# EAGLE design power-control (EAGLE 6.4)
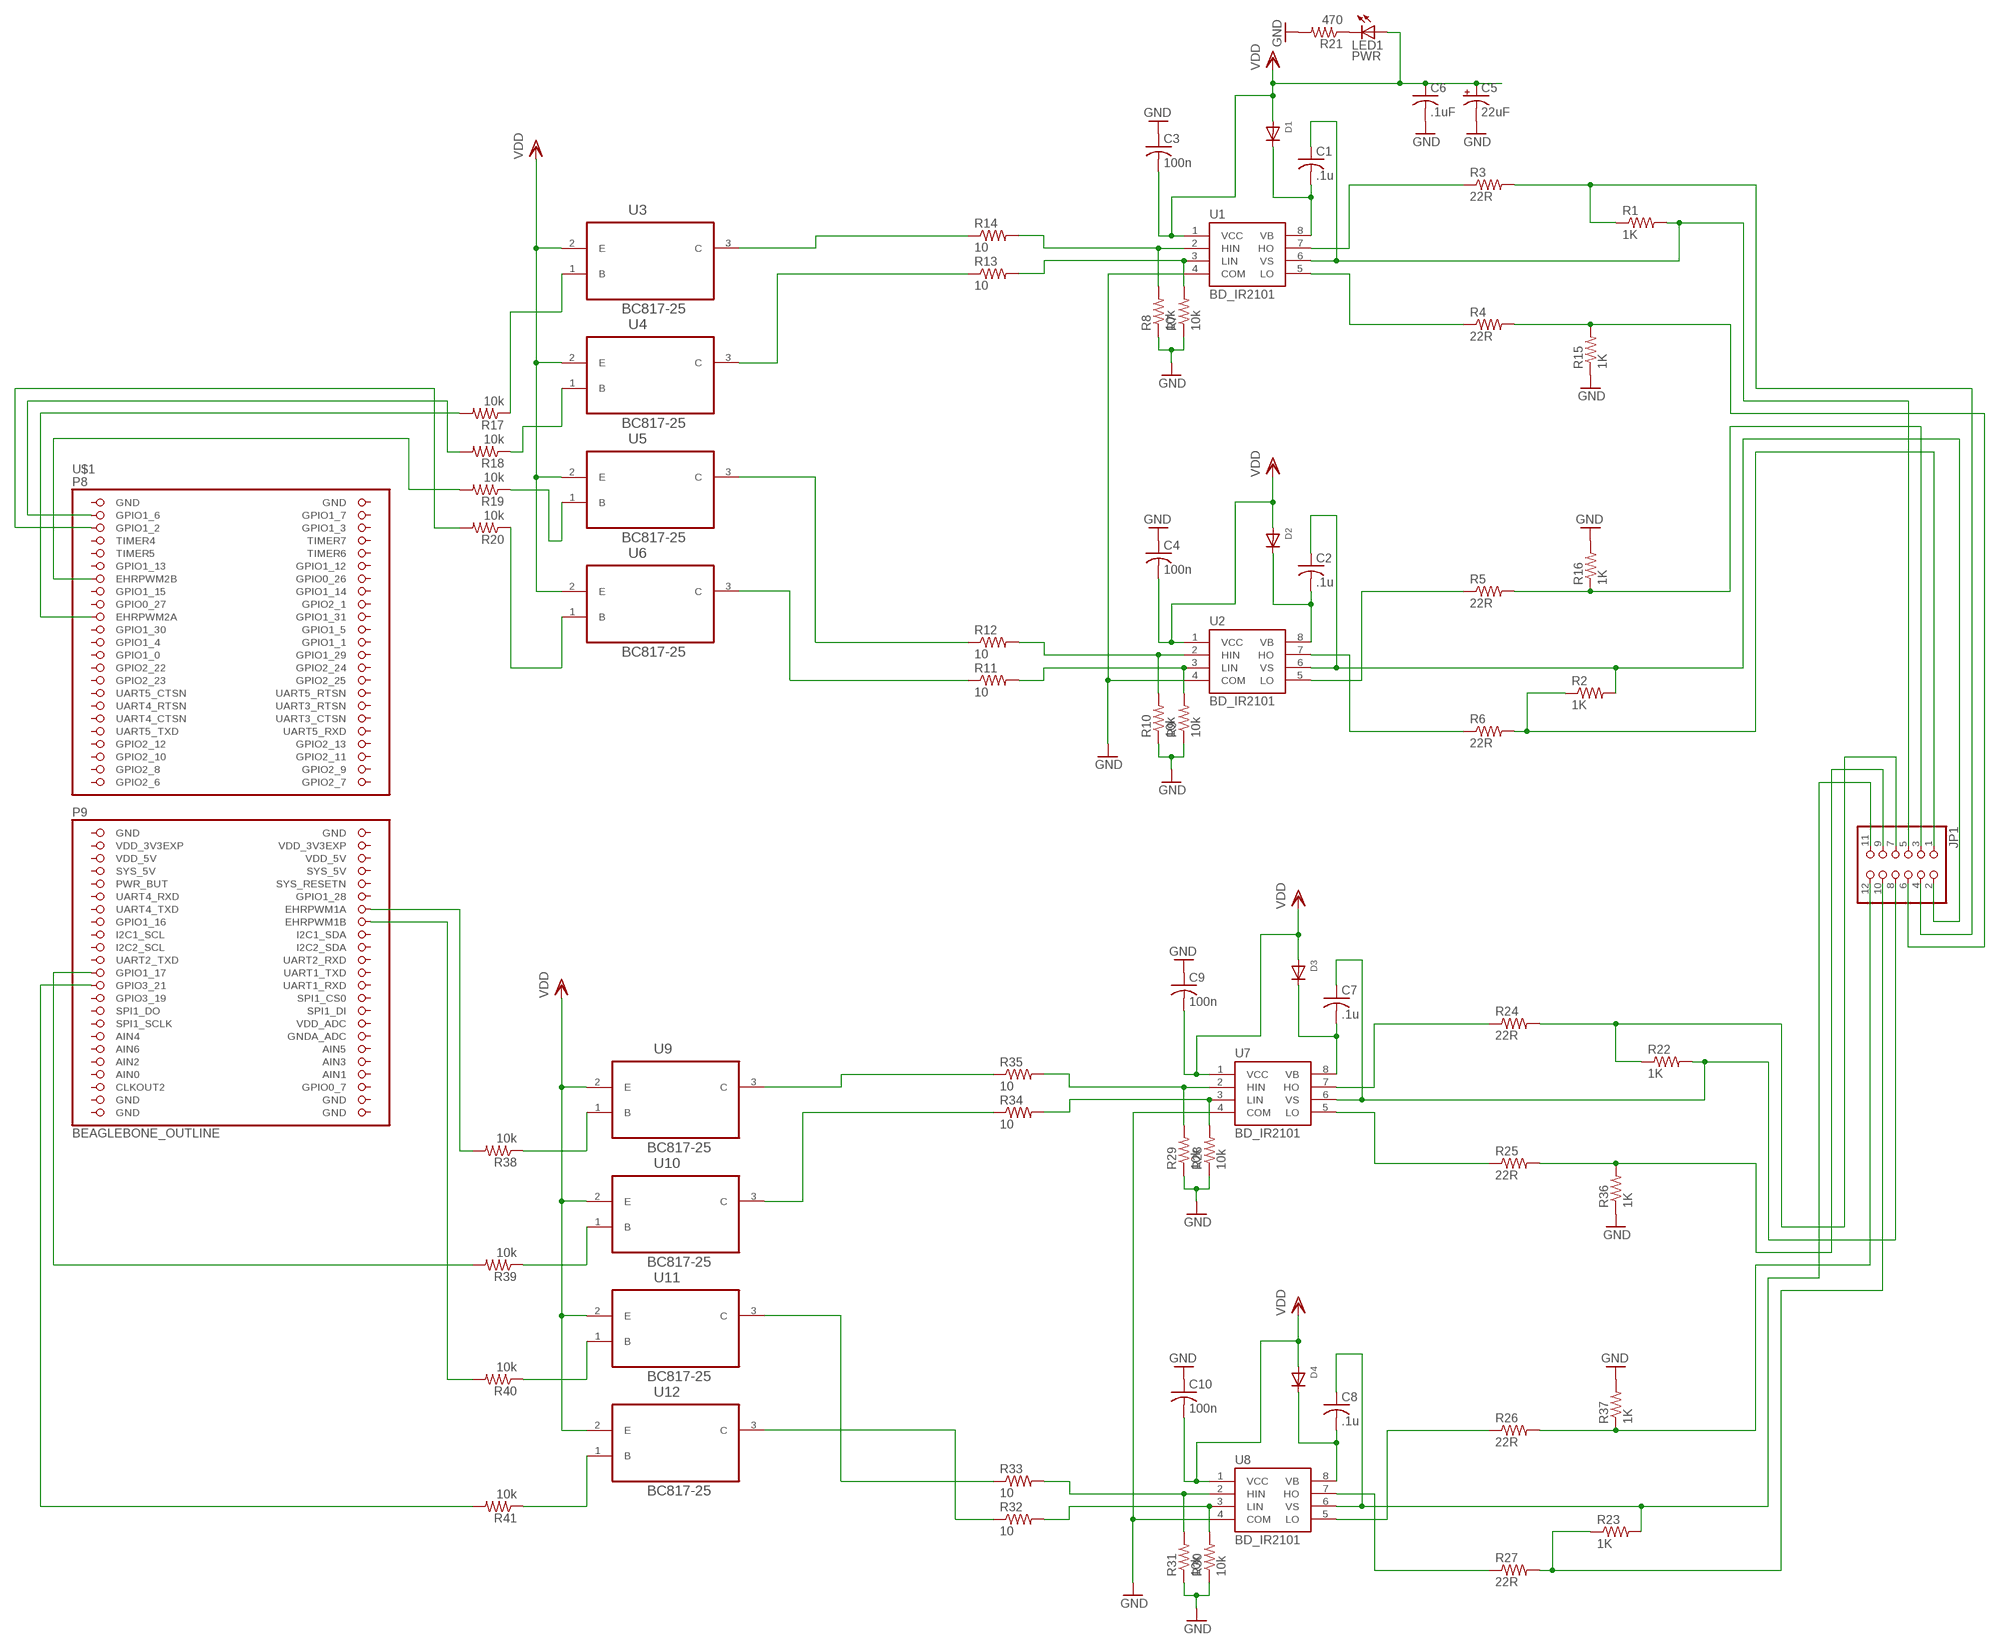
[diagram p0: schematic, sheet 1]

## Parts
C1  .1u  C-USC0402  [C0402]
C2  .1u  C-USC0402  [C0402]
C3  100n  C-USC0402  [C0402]
C4  100n  C-USC0402  [C0402]
C5  22uF  CPOL-USB/3528-21W  [B/3528-21W]
C6  .1uF  C-USC0805  [C0805]
C7  .1u  C-USC0402  [C0402]
C8  .1u  C-USC0402  [C0402]
C9  100n  C-USC0402  [C0402]
C10  100n  C-USC0402  [C0402]
D1  DIODESOD-523  [SOD-523]
D2  DIODESOD-523  [SOD-523]
D3  DIODESOD-523  [SOD-523]
D4  DIODESOD-523  [SOD-523]
JP1  PINHD-2X6_2.00  [2X06M]
LED1  PWR  LEDCHIP-LED0805  [CHIP-LED0805]
R1  1K  R-US_R0603  [R0603]
R2  1K  R-US_R0603  [R0603]
R3  22R  R-US_R0603  [R0603]
R4  22R  R-US_R0603  [R0603]
R5  22R  R-US_R0603  [R0603]
R6  22R  R-US_R0603  [R0603]
R7  10k  R-US_R0603  [R0603]
R8  10k  R-US_R0603  [R0603]
R9  10k  R-US_R0603  [R0603]
R10  10k  R-US_R0603  [R0603]
R11  10  R-US_R0603  [R0603]
R12  10  R-US_R0603  [R0603]
R13  10  R-US_R0603  [R0603]
R14  10  R-US_R0603  [R0603]
R15  1K  R-US_R0603  [R0603]
R16  1K  R-US_R0603  [R0603]
R17  10k  R-US_R0603  [R0603]
R18  10k  R-US_R0603  [R0603]
R19  10k  R-US_R0603  [R0603]
R20  10k  R-US_R0603  [R0603]
R21  470  R-US_R0201  [R0201]
R22  1K  R-US_R0603  [R0603]
R23  1K  R-US_R0603  [R0603]
R24  22R  R-US_R0603  [R0603]
R25  22R  R-US_R0603  [R0603]
R26  22R  R-US_R0603  [R0603]
R27  22R  R-US_R0603  [R0603]
R28  10k  R-US_R0603  [R0603]
R29  10k  R-US_R0603  [R0603]
R30  10k  R-US_R0603  [R0603]
R31  10k  R-US_R0603  [R0603]
R32  10  R-US_R0603  [R0603]
R33  10  R-US_R0603  [R0603]
R34  10  R-US_R0603  [R0603]
R35  10  R-US_R0603  [R0603]
R36  1K  R-US_R0603  [R0603]
R37  1K  R-US_R0603  [R0603]
R38  10k  R-US_R0603  [R0603]
R39  10k  R-US_R0603  [R0603]
R40  10k  R-US_R0603  [R0603]
R41  10k  R-US_R0603  [R0603]
U1  BD_IR2101  [SO8]
U2  BD_IR2101  [SO8]
U3  BC817-25  [SOT95P240X97-3N]
U4  BC817-25  [SOT95P240X97-3N]
U5  BC817-25  [SOT95P240X97-3N]
U6  BC817-25  [SOT95P240X97-3N]
U7  BD_IR2101  [SO8]
U8  BD_IR2101  [SO8]
U9  BC817-25  [SOT95P240X97-3N]
U10  BC817-25  [SOT95P240X97-3N]
U11  BC817-25  [SOT95P240X97-3N]
U12  BC817-25  [SOT95P240X97-3N]
U$1  BEAGLEBONE_OUTLINE  [BEAGLEBONE_SHIELD]

## Nets
GND: C3.1 C4.1 C5.- C6.2 C9.1 C10.1 R7.1 R8.1 R9.1 R10.1 R15.1 R16.2 R21.2 R28.1 R29.1 R30.1 R31.1 R36.1 R37.2 U1.4(COM) U2.4(COM) U7.4(COM) U8.4(COM)
HO_1: R3.1 U1.7(HO)
HO_2: R6.1 U2.7(HO)
HO_3: R24.1 U7.7(HO)
HO_4: R27.1 U8.7(HO)
LO_1: R4.1 U1.5(LO)
LO_2: R5.1 U2.5(LO)
LO_3: R25.1 U7.5(LO)
LO_4: R26.1 U8.5(LO)
M1_G1_H: JP1.4 R1.1 R3.2
M1_G1_L: JP1.6 R4.2 R15.2
M1_G2_H: JP1.1 R2.1 R6.2
M1_G2_L: JP1.3 R5.2 R16.1
M2_G1_H: JP1.7 R22.1 R24.2
M2_G1_L: JP1.9 R25.2 R36.2
M2_G2_H: JP1.10 R23.1 R27.2
M2_G2_L: JP1.12 R26.2 R37.1
MOTOR_OUT_1: C1.1 JP1.5 R1.2 U1.6(VS)
MOTOR_OUT_2: C2.1 JP1.2 R2.2 U2.6(VS)
MOTOR_OUT_3: C7.1 JP1.8 R22.2 U7.6(VS)
MOTOR_OUT_4: C8.1 JP1.11 R23.2 U8.6(VS)
N$1: R13.1 U4.3(C)
N$2: R11.1 U6.3(C)
N$3: R8.2 R14.2 U1.2(HIN)
N$4: R7.2 R13.2 U1.3(LIN)
N$5: R10.2 R12.2 U2.2(HIN)
N$6: R9.2 R11.2 U2.3(LIN)
N$7: C1.2 D1.K(C) U1.8(VB)
N$8: C2.2 D2.K(C) U2.8(VB)
N$9: R12.1 U5.3(C)
N$10: R19.2 U$1.13(EHRPWM2B)
N$11: R14.1 U3.3(C)
N$12: R18.2 U$1.3(GPIO1_6)
N$13: R20.2 U$1.5(GPIO1_2)
N$14: R38.2 U$1.60(EHRPWM1A)
N$15: R40.2 U$1.62(EHRPWM1B)
N$16: R39.2 U$1.69(GPIO1_17)
N$17: R17.1 U3.1(B)
N$18: R18.1 U4.1(B)
N$19: R19.1 U5.1(B)
N$20: R17.2 U$1.19(EHRPWM2A)
N$21: R20.1 U6.1(B)
N$22: LED1.C R21.1
N$23: R29.2 R35.2 U7.2(HIN)
N$24: R28.2 R34.2 U7.3(LIN)
N$25: R41.2 U$1.71(GPIO3_21)
N$26: R31.2 R33.2 U8.2(HIN)
N$27: R30.2 R32.2 U8.3(LIN)
N$28: C7.2 D3.K(C) U7.8(VB)
N$29: C8.2 D4.K(C) U8.8(VB)
N$30: R34.1 U10.3(C)
N$31: R35.1 U9.3(C)
N$32: R32.1 U12.3(C)
N$33: R33.1 U11.3(C)
N$42: R38.1 U9.1(B)
N$43: R39.1 U10.1(B)
N$44: R40.1 U11.1(B)
N$45: R41.1 U12.1(B)
VDD: C3.2 C4.2 C5.+ C6.1 C9.2 C10.2 D1.A D2.A D3.A D4.A LED1.A U1.1(VCC) U2.1(VCC) U3.2(E) U4.2(E) U5.2(E) U6.2(E) U7.1(VCC) U8.1(VCC) U9.2(E) U10.2(E) U11.2(E) U12.2(E)
Unconnected: U$1.4(GPIO1_7) U$1.6(GPIO1_3) U$1.7(TIMER4) U$1.8(TIMER7) U$1.9(TIMER5) U$1.10(TIMER6) U$1.11(GPIO1_13) U$1.12(GPIO1_12) U$1.14(GPIO0_26) U$1.15(GPIO1_15) U$1.16(GPIO1_14) U$1.17(GPIO0_27) U$1.18(GPIO2_1) U$1.20(GPIO1_31) U$1.21(GPIO1_30) U$1.22(GPIO1_5) U$1.23(GPIO1_4) U$1.24(GPIO1_1) U$1.25(GPIO1_0) U$1.26(GPIO1_29) U$1.27(GPIO2_22) U$1.28(GPIO2_24) U$1.29(GPIO2_23) U$1.30(GPIO2_25) U$1.31(UART5_CTSN) U$1.32(UART5_RTSN) U$1.33(UART4_RTSN) U$1.34(UART3_RTSN) U$1.35(UART4_CTSN) U$1.36(UART3_CTSN) U$1.37(UART5_TXD) U$1.38(UART5_RXD) U$1.39(GPIO2_12) U$1.40(GPIO2_13) U$1.41(GPIO2_10) U$1.42(GPIO2_11) U$1.43(GPIO2_8) U$1.44(GPIO2_9) U$1.45(GPIO2_6) U$1.46(GPIO2_7) U$1.54(SYS_5V) U$1.55(PWR_BUT) U$1.56(SYS_RESETN) U$1.57(UART4_RXD) U$1.58(GPIO1_28) U$1.59(UART4_TXD) U$1.61(GPIO1_16) U$1.63(I2C1_SCL) U$1.64(I2C1_SDA) U$1.65(I2C2_SCL) U$1.66(I2C2_SDA) U$1.67(UART2_TXD) U$1.68(UART2_RXD) U$1.70(UART1_TXD) U$1.72(UART1_RXD) U$1.73(GPIO3_19) U$1.74(SPI1_CS0) U$1.75(SPI1_DO) U$1.76(SPI1_DI) U$1.77(SPI1_SCLK) U$1.78(VDD_ADC) U$1.79(AIN4) U$1.80(GNDA_ADC) U$1.81(AIN6) U$1.82(AIN5) U$1.83(AIN2) U$1.84(AIN3) U$1.86(AIN1) U$1.87(CLKOUT2) U$1.88(GPIO0_7)

## Power pins joined to a net without a drawn wire
AIN0: U$1.85(AIN0)
GND: U$1.1(GND) U$1.2(GND) U$1.47(GND) U$1.48(GND) U$1.89(GND) U$1.90(GND) U$1.91(GND) U$1.92(GND)
SYS_5V: U$1.53(SYS_5V)
VDD_3V3EXP: U$1.49(VDD_3V3EXP) U$1.50(VDD_3V3EXP)
VDD_5V: U$1.51(VDD_5V) U$1.52(VDD_5V)

## Library data of the parts
C1-C4 C6-C10 = rcl:C-US: CAPACITOR, American symbol
C5 = rcl:CPOL-US: POLARIZED CAPACITOR, American symbol
D1-D4 = adafruit:DIODE: Diode SMADIODE - SMA Surface Mount Package 20V 1A Schottky Diode Digikey: 641-1014-6-ND DO-1N4148 - Through Hole Small Current Diode SOD-123 20V 1 A (.5mV Vf) Schottky Diode - Digikey: MBRX120TPMSCT-ND SOD-323 10V 570mA (.38mV Vf, 3ns) Schottky Diode - Digikey: ZLLS410CT-ND SOD-523 30V 30mA Schottky Diode (RB751S-40TE61) - Digikey: RB751S-40TE61CT-ND SOT23-R/W - SOT23 Package (R = Solder Paste/Reflow Ovens, W = Hand-Soldering) BAT54Film 40V 300mA - Digikey: 497-7162-1-ND
JP1 = pinhead-1:PINHD-2X6: PIN HEADER
LED1 = adafruit:LED: LED OSRAM: - CHIPLED LG R971, LG N971, LY N971, LG Q971, LY Q971, LO R971, LY R971 LH N974, LH R974 LS Q976, LO Q976, LY Q976 LO Q996 - Hyper CHIPLED LW Q18S LB Q993, LB Q99A, LB R99A - SideLED LS A670, LO A670, LY A670, LG A670, LP A670 LB A673, LV A673, LT A673, LW A673 LH A674 LY A675 LS A676, LA A676, LO A676, LY A676, LW A676 LS A679, LY A679, LG A679 - Hyper Micro SIDELED® LS Y876, LA Y876, LO Y876, LY Y876 LT Y87S - SmartLED LW L88C, LW L88S LB L89C, LB L89S, LG L890 LS L89K, LO L89K, LY L89K LS L896, LA L896, LO L896, LY L896 - TOPLED LS T670, LO T670, LY T670, LG T670, LP T670 LSG T670, LSP T670, LSY T670, LOP T670, LYG T670 LG T671, LOG T671, LSG T671 LB T673, LV T673, LT T673, LW T673 LH T674 LS T676, LA T676, LO T676, LY T676, LB T676, LH T676, LSB T676, LW T676 LB T67C, LV T67C, LT T67C, LS T67K, LO T67K, LY T67K, LW E67C LS E67B, LA E67B, LO E67B, LY E67B, LB E67C, LV E67C, LT E67C LW T67C LS T679, LY T679, LG T679 LS T770, LO T770, LY T770, LG T770, LP T770 LB T773, LV T773, LT T773, LW T773 LH T774 LS E675, LA E675, LY E675, LS T675 LS T776, LA T776, LO T776, LY T776, LB T776 LHGB T686 LT T68C, LB T68C - Hyper Mini TOPLED® LB M676 - Mini TOPLED Santana® LG M470 LS M47K, LO M47K, LY M47K Source: http://www.osram.convergy.de/
R1-R41 = rcl:R-US_: RESISTOR, American symbol
U1 U2 U7 U8 = open-bldc:BD
U3-U6 U9-U12 = Fairchild_By_element14_Batch_1:BC817-25: NPN Epitaxial Silicon Transistor; MPN: BC817-25; OC_FARNELL: 1228216; OC_NEWARK: -; PACKAGE: SOT-3; SUPPLIER: Fairchild
U$1 = adafruit:BEAGLEBONE_OUTLINE: Should match A3 pinout - but not completely tested

## Board
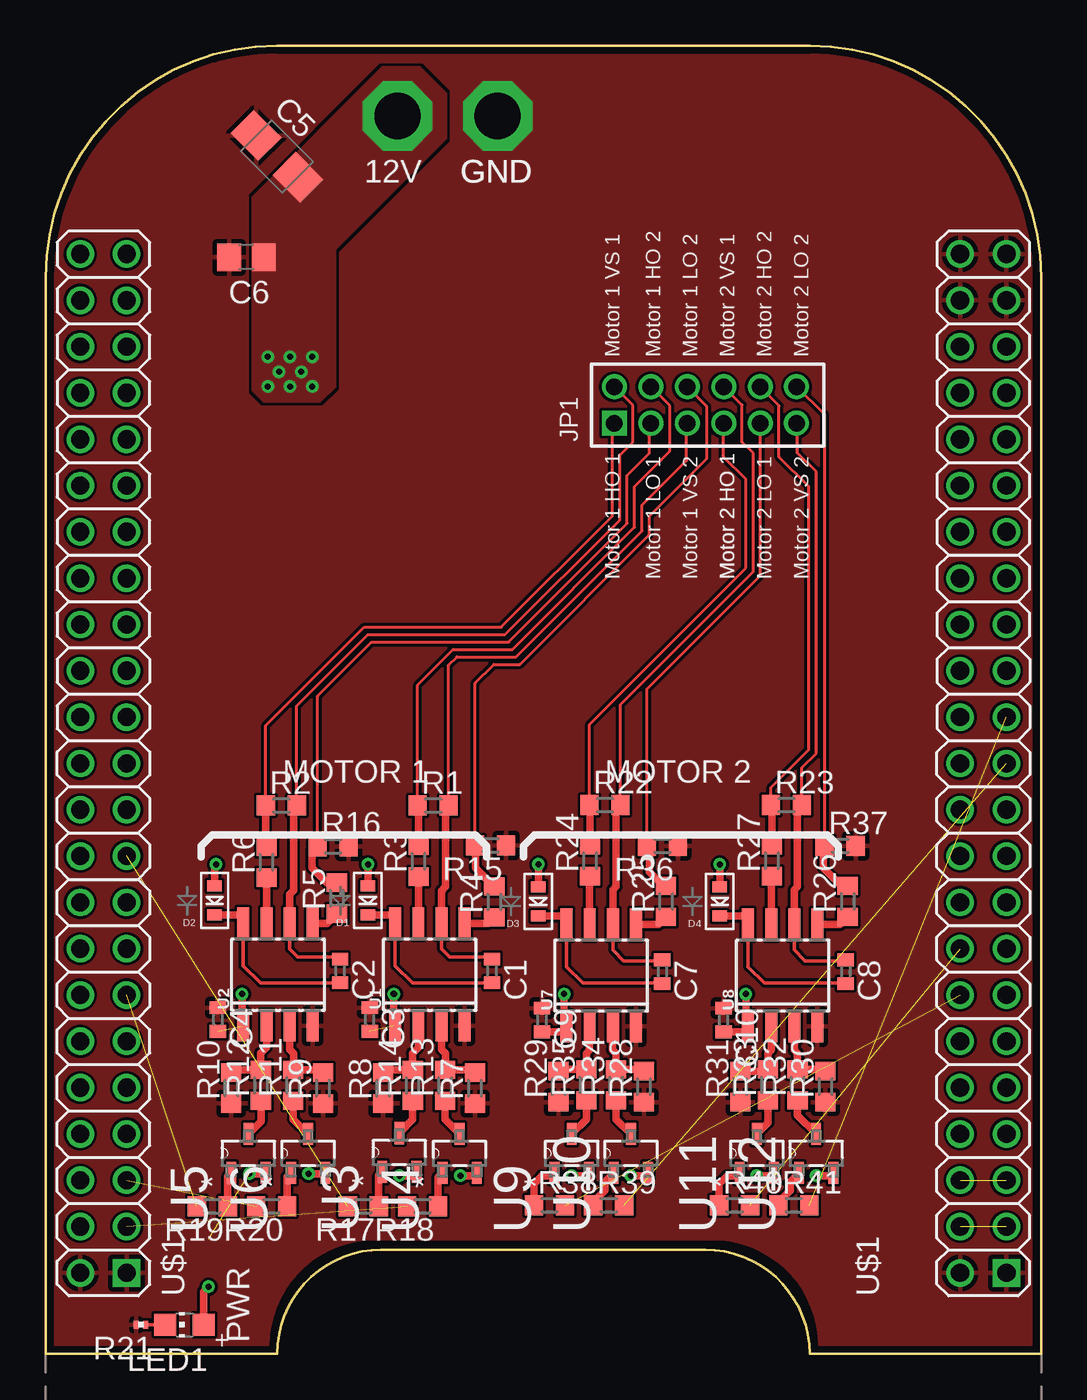
[diagram p1: board, top side]
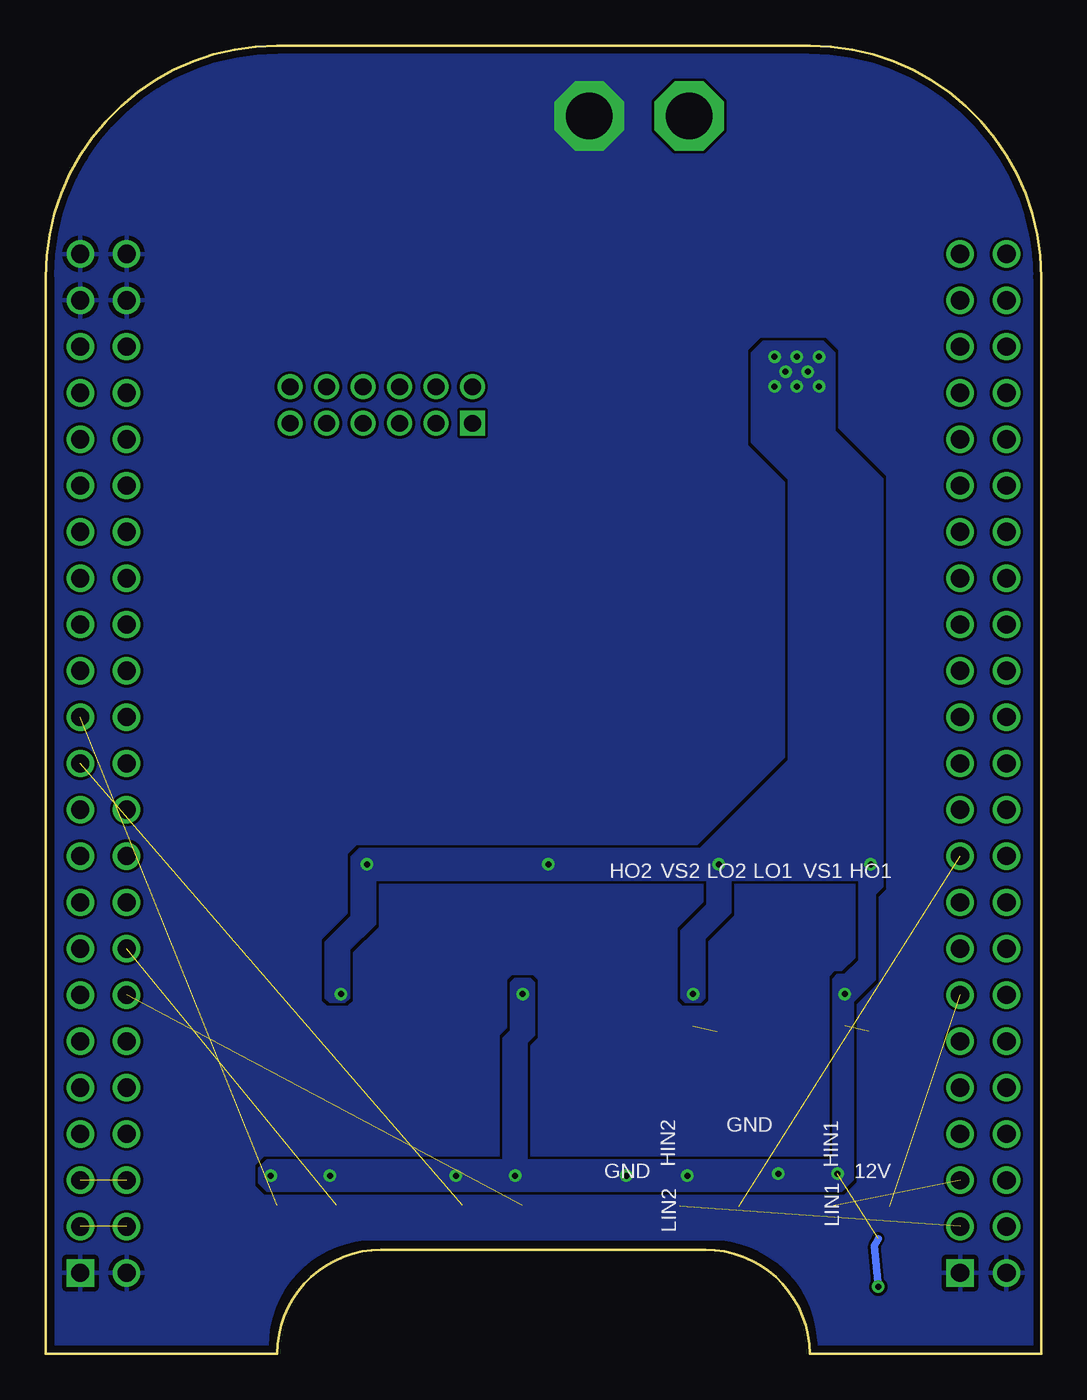
[diagram p2: board, bottom side, seen from below]

Size 54.61 x 71.75 mm. Coordinates in mm from the lower left corner, seen from the top.
Copper layers (1*16): Top 0.0356mm / dielectric 1.5011mm / Bottom 0.0356mm
Design rules "LaenPCBOrder *": minimum track width 6mil, minimum drill 13mil, track to track 6mil, track to pad 6mil, pad to pad 6mil, via to via 6mil, smd to smd 6mil, copper to edge 15mil, drill to drill 6mil, minimum pad ring 7mil, minimum via ring 7mil, stop-mask expansion 4mil, vias tented up to drill 14mil, thermal gap 10mil

### Footprints (pad centres in the part's own frame; a part is rotated, then mirrored left to right if it is on the bottom)
C0402 = smd 0.7 x 0.9: 1 -0.65,0; 2 0.65,0
B/3528-21W = smd 2.15 x 1.8: + 1.625,0; - -1.625,0
C0805 = smd 1.3 x 1.5: 1 -0.95,0; 2 0.95,0
SOD-523 = smd 0.8 x 0.6: A 0,-0.8; K 0,0.8
2X06M = drill 0.914 square: 1 -5,-1 | drill 0.914: 2 -5,1; 3 -3,-1; 4 -3,1; 5 -1,-1; 6 -1,1; 7 1,-1; 8 1,1; 9 3,-1; 10 3,1; 11 5,-1; 12 5,1
CHIP-LED0805 = smd 1.2 x 1.2: A 0,-1.05; C 0,1.05
R0603 = smd 1 x 1.1: 1 -0.85,0; 2 0.85,0
R0201 = smd 0.28 x 0.43: 1 -0.255,0; 2 0.255,0
SO8 = smd 0.65 x 1.75: 1 -1.905,-2.8; 2 -0.635,-2.8; 3 0.635,-2.8; 4 1.905,-2.8; 5 1.905,2.8; 6 0.635,2.8; 7 -0.635,2.8; 8 -1.905,2.8
SOT95P240X97-3N = smd 1.219 x 0.533: 1 -1.067,0.94; 2 -1.067,-0.94; 3 1.067,0
BEAGLEBONE_SHIELD = drill 1 square: 1 4.445,19.05; 47 52.705,19.05 | drill 1: 2 1.905,19.05; 3 4.445,21.59; 4 1.905,21.59; 5 4.445,24.13; 6 1.905,24.13; 7 4.445,26.67; 8 1.905,26.67; 9 4.445,29.21; 10 1.905,29.21; 11 4.445,31.75; 12 1.905,31.75; 13 4.445,34.29; 14 1.905,34.29; 15 4.445,36.83; 16 1.905,36.83; 17 4.445,39.37; 18 1.905,39.37; 19 4.445,41.91; 20 1.905,41.91; 21 4.445,44.45; 22 1.905,44.45; 23 4.445,46.99; 24 1.905,46.99; 25 4.445,49.53; 26 1.905,49.53; 27 4.445,52.07; 28 1.905,52.07; 29 4.445,54.61; 30 1.905,54.61; 31 4.445,57.15; 32 1.905,57.15; 33 4.445,59.69; 34 1.905,59.69; 35 4.445,62.23; 36 1.905,62.23; 37 4.445,64.77; 38 1.905,64.77; 39 4.445,67.31; 40 1.905,67.31; 41 4.445,69.85; 42 1.905,69.85; 43 4.445,72.39; 44 1.905,72.39; 45 4.445,74.93; 46 1.905,74.93; 48 50.165,19.05; 49 52.705,21.59; 50 50.165,21.59; 51 52.705,24.13; 52 50.165,24.13; 53 52.705,26.67; 54 50.165,26.67; 55 52.705,29.21; 56 50.165,29.21; 57 52.705,31.75; 58 50.165,31.75; 59 52.705,34.29; 60 50.165,34.29; 61 52.705,36.83; 62 50.165,36.83; 63 52.705,39.37; 64 50.165,39.37; 65 52.705,41.91; 66 50.165,41.91; 67 52.705,44.45; 68 50.165,44.45; 69 52.705,46.99; 70 50.165,46.99; 71 52.705,49.53; 72 50.165,49.53; 73 52.705,52.07; 74 50.165,52.07; 75 52.705,54.61; 76 50.165,54.61; 77 52.705,57.15; 78 50.165,57.15; 79 52.705,59.69; 80 50.165,59.69; 81 52.705,62.23; 82 50.165,62.23; 83 52.705,64.77; 84 50.165,64.77; 85 52.705,67.31; 86 50.165,67.31; 87 52.705,69.85; 88 50.165,69.85; 89 52.705,72.39; 90 50.165,72.39; 91 52.705,74.93; 92 50.165,74.93

### Placement (x,y rotation side)
C1  24.49,21.01 270 top
C2  16.15,21.01 270 top
C3  17.78,18.34 270 top
C4  9.45,18.34 270 top
C5  12.69,65.68 315 top
C6  11.02,60.15 180 top
C7  33.83,20.95 270 top
C8  43.89,20.95 270 top
C9  27.23,18.31 270 top
C10  37.19,18.31 270 top
D1  17.68,24.87 180 top
D2  9.27,24.87 180 top
D3  27.03,24.82 180 top
D4  36.98,24.82 180 top
JP1  36.19,52.04 0 top
LED1  7.62,1.6 90 top
R1  21.26,30.07 0 top
R2  12.93,30.07 0 top
R3  20.45,27.03 90 top
R4  24.61,24.79 90 top
R5  15.98,24.99 90 top
R6  12.12,26.97 90 top
R7  23.55,14.58 90 top
R8  18.52,14.58 90 top
R9  15.21,14.58 90 top
R10  10.19,14.58 90 top
R11  13.59,14.73 90 top
R12  11.81,14.73 90 top
R13  21.92,14.73 90 top
R14  20.14,14.73 90 top
R15  24.41,27.89 180 top
R16  15.77,27.84 0 top
R17  17.42,8.1 180 top
R18  20.68,8.1 180 top
R19  9.14,8.1 180 top
R20  12.4,8.1 180 top
R21  5.23,1.6 180 top
R22  30.68,30.1 0 top
R23  40.64,30.1 0 top
R24  29.87,27.05 90 top
R25  34.04,24.82 90 top
R26  43.99,24.82 90 top
R27  39.83,27.05 90 top
R28  32.82,14.66 90 top
R29  28.14,14.66 90 top
R30  42.77,14.66 90 top
R31  38.1,14.66 90 top
R32  41.25,14.76 90 top
R33  39.62,14.76 90 top
R34  31.29,14.76 90 top
R35  29.67,14.76 90 top
R36  33.83,27.86 180 top
R37  43.59,27.86 0 top
R38  27.64,8.15 0 top
R39  30.89,8.15 0 top
R40  37.8,8.15 0 top
R41  41.05,8.15 0 top
U1  21.08,20.8 0 top
U2  12.75,20.8 0 top
U3  19.41,11.05 90 top
U4  22.71,11 90 top
U5  11.13,11 90 top
U6  14.4,11 90 top
U7  30.48,20.75 0 top
U8  40.44,20.75 0 top
U9  28.85,11 90 top
U10  32.11,11 90 top
U11  39.01,11 90 top
U12  42.27,11 90 top
U$1  0,-14.61 0 top

### Tracks (layer width: path | path; a pad name or v marks a point on that pad's centre or on a via)
GND  (via drill 2.54 pad 3.81)
  other vias: 24.79,67.89
  pour Bottom (rank 6): 26.42,71.35 13,71.35 arc90 0.41,58.75 0.41,0.43 12.19,0.43 arc-90 18.08,6.32 27.43,6.32 36.58,6.32 arc-90 42.47,0.43 54.05,0.43 54.05,59.16 arc90 41.86,71.35
  pour Top (rank 6): 26.42,71.35 13,71.35 arc90 0.41,58.75 0.41,0.43 12.19,0.43 arc-90 18.08,6.32 27.43,6.32 36.58,6.32 arc-90 42.47,0.43 54.05,0.43 54.05,59.16 arc90 41.86,71.35
HO_1
  Top 0.406: U1.7 R3.1
HO_2
  Top 0.406: U2.7 R6.1
HO_3
  Top 0.406: U7.7 29.84,26.18 R24.1
HO_4
  Top 0.406: U8.7 39.8,26.18 R27.1
LO_1
  Top 0.406: U1.5 24.27,23.6 R4.1
LO_2
  Top 0.406: U2.5 15.44,23.6 R5.1
LO_3
  Top 0.406: U7.5 33.62,23.55 R25.1
LO_4
  Top 0.406: U8.5 43.58,23.55 R26.1
M1_G1_H
  Top 0.178: R1.1 20.41,36.69 22.35,38.63 25.6,38.63 32.31,45.34 32.31,47.57 34.24,49.5 34.24,52 JP1.4
  Top 0.406: R3.2 20.45,30.04 R1.1
M1_G1_L
  Top 0.178: R15.2 23.56,36.79 24.59,37.82 26.01,37.82 33.12,44.93 33.12,45.95 36.27,49.1 36.27,51.97 JP1.6
  Top 0.406: R4.2 24.58,25.64 23.57,26.64 23.57,27.88 R15.2
M1_G2_H
  Top 0.178: R2.1 12.08,34.46 17.47,39.85 24.99,39.85 31.09,45.95 31.09,50.94 JP1.1
  Top 0.406: R6.2 12.08,27.82 R2.1
M1_G2_L
  Top 0.178: R16.1 14.92,36.08 17.88,39.04 25.4,39.04 31.9,45.54 31.9,48.18 33.12,49.4 33.12,50.97 JP1.3
  Top 0.406: R5.2 15.43,25.84 14.63,26.64 14.63,27.75 R16.1
M2_G1_H
  Top 0.178: R22.1 29.83,34.53 38.41,43.1 38.41,47.98 37.19,49.2 JP1.7
  Top 0.406: R24.2 29.87,30.06 R22.1
M2_G1_L
  Top 0.178: R36.2 32.98,36.46 39.22,42.7 39.22,51.02 JP1.9
  Top 0.406: R25.2 33.9,25.67 33.12,26.44 33.12,27.72 R36.2
M2_G2_H
  Top 0.178: R23.1 39.79,31.08 41.86,33.15 41.86,47.57 40.23,49.2 40.23,52.01 JP1.10
  Top 0.406: R27.2 39.83,30.06 R23.1
M2_G2_L
  Top 0.178: R37.1 42.74,51.5 JP1.12
  Top 0.406: R26.2 43.65,25.67 42.67,26.64 42.67,27.8 R37.1
MOTOR_OUT_1
  Top 0.178: R1.2 22.11,37.78 22.55,38.23 25.81,38.23 32.72,45.14 32.72,46.56 35.15,49 35.15,51 JP1.5
  Top 0.203: U1.6 21.72,22.2 22.15,21.77 24.37,21.77 C1.1
  Top 0.406: U1.6 21.72,25.4 21.95,25.63 21.95,29.91 R1.2
MOTOR_OUT_2
  Top 0.178: R2.2 13.78,35.55 17.68,39.45 25.2,39.45 31.5,45.75 31.5,49.3 32.21,50.01 32.21,52.03 JP1.2
  Top 0.203: U2.6 13.39,22.2 13.82,21.77 16.04,21.77 C2.1
  Top 0.406: U2.6 13.39,25.2 13.61,25.43 13.61,29.91 R2.2
MOTOR_OUT_3
  Top 0.178: R22.2 31.53,35.62 38.81,42.9 38.81,49.4 38.2,50.01 38.2,52.04 JP1.8
  Top 0.203: U7.6 31.11,22.15 31.7,21.56 33.79,21.56 C7.1
  Top 0.406: U7.6 31.11,25.45 31.29,25.63 31.29,29.86 R22.2
MOTOR_OUT_4
  Top 0.178: R23.2 41.49,32.17 42.27,32.94 42.27,48.39 41.25,49.4 41.25,50.99 JP1.11
  Top 0.203: U8.6 41.07,22.15 41.66,21.56 43.85,21.56 C8.1
  Top 0.406: U8.6 41.07,25.45 41.25,25.63 41.25,29.86 R23.2
N$1
  Top 0.406: R13.1 21.92,12.85 U4.3
N$2
  Top 0.406: R11.1 13.59,12.88 U6.3
N$3
  Top 0.406: U1.2 20.45,16.81 20.12,16.48 20.12,15.61 R14.2 18.67,15.58 R8.2
N$4
  Top 0.406: U1.3 21.72,16.71 21.95,16.48 21.95,15.61 R13.2 23.39,15.58 R7.2
N$5
  Top 0.406: U2.2 12.12,16.81 11.79,16.48 11.79,15.61 R12.2 10.34,15.58 R10.2
N$6
  Top 0.406: U2.3 13.39,16.71 13.61,16.48 13.61,15.61 R11.2 15.06,15.58 R9.2
N$7
  Top 0.203: U1.8 19.18,21.29 20.12,20.35 C1.2
  Top 0.406: D1.K 18.92,24.07 U1.8
N$8
  Top 0.203: U2.8 10.85,21.29 11.79,20.35 C2.2
  Top 0.406: D2.K 10.59,24.07 U2.8
N$9
  Top 0.406: R12.1 11.81,12.75 U5.3
N$10  (1 unrouted)
N$11
  Top 0.406: R14.1 20.14,12.85 U3.3
N$12  (1 unrouted)
N$13  (1 unrouted)
N$14  (1 unrouted)
N$15  (1 unrouted)
N$16  (1 unrouted)
N$17
  Top 0.406: R17.1 18.27,9.79 U3.1
N$18
  Top 0.406: R18.1 21.53,9.69 U4.1
N$19
  Top 0.406: R19.1 9.99,9.74 U5.1
N$20  (1 unrouted)
N$21
  Top 0.406: R20.1 13.24,9.71 U6.1
N$22
  Top 0.203: LED1.C R21.1
N$23
  Top 0.203: 29.87,17.93 U7.2
  Top 0.406: U7.2 29.84,16.66 29.67,16.48 R35.2 28.25,15.61 R29.2
N$24
  Top 0.203: 31.09,17.93 U7.3
  Top 0.406: 31.09,17.93 31.09,16.69 31.29,16.48 R34.2 32.72,15.61 R28.2
N$25  (1 unrouted)
N$26
  Top 0.406: U8.2 39.8,16.66 39.62,16.48 R33.2 39.52,15.51 R31.2
N$27
  Top 0.406: U8.3 41.07,16.66 41.25,16.48 R32.2 42.67,15.61 R30.2
N$28
  Top 0.203: U7.8 28.58,21.23 29.46,20.35 33.79,20.35 C7.2
  Top 0.406: D3.K 28.58,24.02 U7.8
N$29
  Top 0.203: U8.8 38.53,21.23 39.42,20.35 43.85,20.35 C8.2
  Top 0.406: D4.K 38.53,24.02 U8.8
N$30
  Top 0.406: R34.1 31.29,12.88 U10.3
N$31
  Top 0.406: R35.1 29.67,12.88 U9.3
N$32
  Top 0.406: R32.1 41.25,13.08 U12.3
N$33
  Top 0.406: R33.1 39.62,12.67 U11.3
N$42
  Top 0.406: R38.1 26.78,9.34 27.23,9.78 27.76,9.78 U9.1
N$43
  Top 0.406: R39.1 30.04,8.32 30.68,8.97 30.68,9.45 U10.1
N$44
  Top 0.406: R40.1 36.94,9.34 37.39,9.78 37.92,9.78 U11.1
N$45
  Top 0.406: R41.1 40.2,8.32 40.84,8.97 40.84,9.45 U12.1
VDD  (via drill 0.33, 2.54 pad 3.81)  (3 unrouted)
  Top 0.406: C9.2 28.29,17.66 U7.1 28.45,17.95 v28.45,19.74 | C10.2 38.24,17.66 U8.1 38.41,17.95 v38.41,19.74 | v42.27,9.78 43.2,9.78 U12.2 | v39.01,9.78 39.95,9.78 U11.2 | v32.11,9.78 33.05,9.78 U10.2 | v28.85,9.78 29.79,9.78 U9.2 | v22.76,9.78 23.65,9.78 U4.2 | v19.41,9.78 20.34,9.78 U3.2 | v14.43,9.88 15.34,9.88 U6.2 | v11.18,9.88 12.06,9.88 U5.2 | U2.1 10.77,18 v10.77,19.74 | U1.1 19.1,18 v19.1,19.74 | D4.A v36.98,26.85 | D3.A v27.03,26.85 | v17.68,26.85 D1.A | v9.35,26.85 9.27,26.85 D2.A | LED1.A 8.67,3.41 v8.94,3.68
  Bottom 0.406: v8.94,3.68 9.14,5.92 8.94,6.32
  other vias: 19.3,67.89 12.19,54.69 13.41,54.69 14.63,54.69 12.8,53.87 14.02,53.87 12.19,53.06 13.41,53.06 14.63,53.06
  pour Bottom (rank 5): 8.74,27.66 37.39,27.66 37.8,27.25 37.8,26.44 37.39,26.04 8.74,26.04
  pour Bottom (rank 5): 9.96,27.66 9.96,21.56 10.77,20.75 11.18,20.75 11.38,20.55 11.38,10.79 11.58,10.59 42.47,10.59 42.88,10.19 42.88,9.37 42.47,8.97 10.97,8.97 10.36,9.58 10.36,19.33 9.14,20.55 9.14,25.22 8.74,25.63 8.74,27.66
  pour Bottom (rank 5): 17.07,27.66 17.07,24.21 18.49,22.78 18.49,19.53 18.69,19.33 19.51,19.33 19.71,19.53 19.71,23.19 18.29,24.61 18.29,27.66
  pour Bottom (rank 5): 29.46,8.97 29.46,17.3 29.06,17.7 29.06,20.35 28.85,20.55 28.04,20.55 27.84,20.35 27.84,17.5 28.24,17.09 28.24,8.97
  pour Bottom (rank 5): 37.8,27.25 37.8,24 39.22,22.58 39.22,19.53 39.01,19.33 38.2,19.33 38,19.53 38,22.17 36.58,23.6 36.58,27.66 37.39,27.66
  pour Top (rank 5, no thermals): 19.3,70.54 20.52,70.54 21.95,69.11 21.95,66.67 15.85,60.58 15.85,53.06 15.04,52.25 11.99,52.25 11.38,52.86 11.38,63.42 18.49,70.54
  pour Bottom (rank 5): 8.74,26.44 8.74,47.98 11.38,50.62 11.38,54.89 11.99,55.5 15.24,55.5 15.85,54.89 15.85,50.01 13.82,47.98 13.82,32.54 18.69,27.66 18.69,26.24 18.49,26.04 9.14,26.04
VDD_3V3EXP  (1 unrouted)
VDD_5V  (1 unrouted)

### Text on the board
tPlace: 12V | GND | GND | GND | GND | Motor 1 VS 1 | Motor 1 HO 2 | Motor 1 LO 2 | Motor 2 VS 1 | Motor 2 HO 2 | Motor 2 LO 2 | Motor 1 HO 1 | Motor 1 LO 1 | Motor 1 VS 2 | Motor 2 HO 1 | Motor 2 HO 1 | Motor 2 LO 1 | Motor 2 VS 2 | MOTOR 1 | MOTOR 2 | PWR
bPlace: HO1 | VS1 | LO1 | LO2 | VS2 | HO2 | GND | HIN1 | HIN2 | 12V | GND | LIN1 | LIN2